# EAGLE design core-feather-shield-adc-imu-basic_v2_0 (EAGLE 9.5.0)
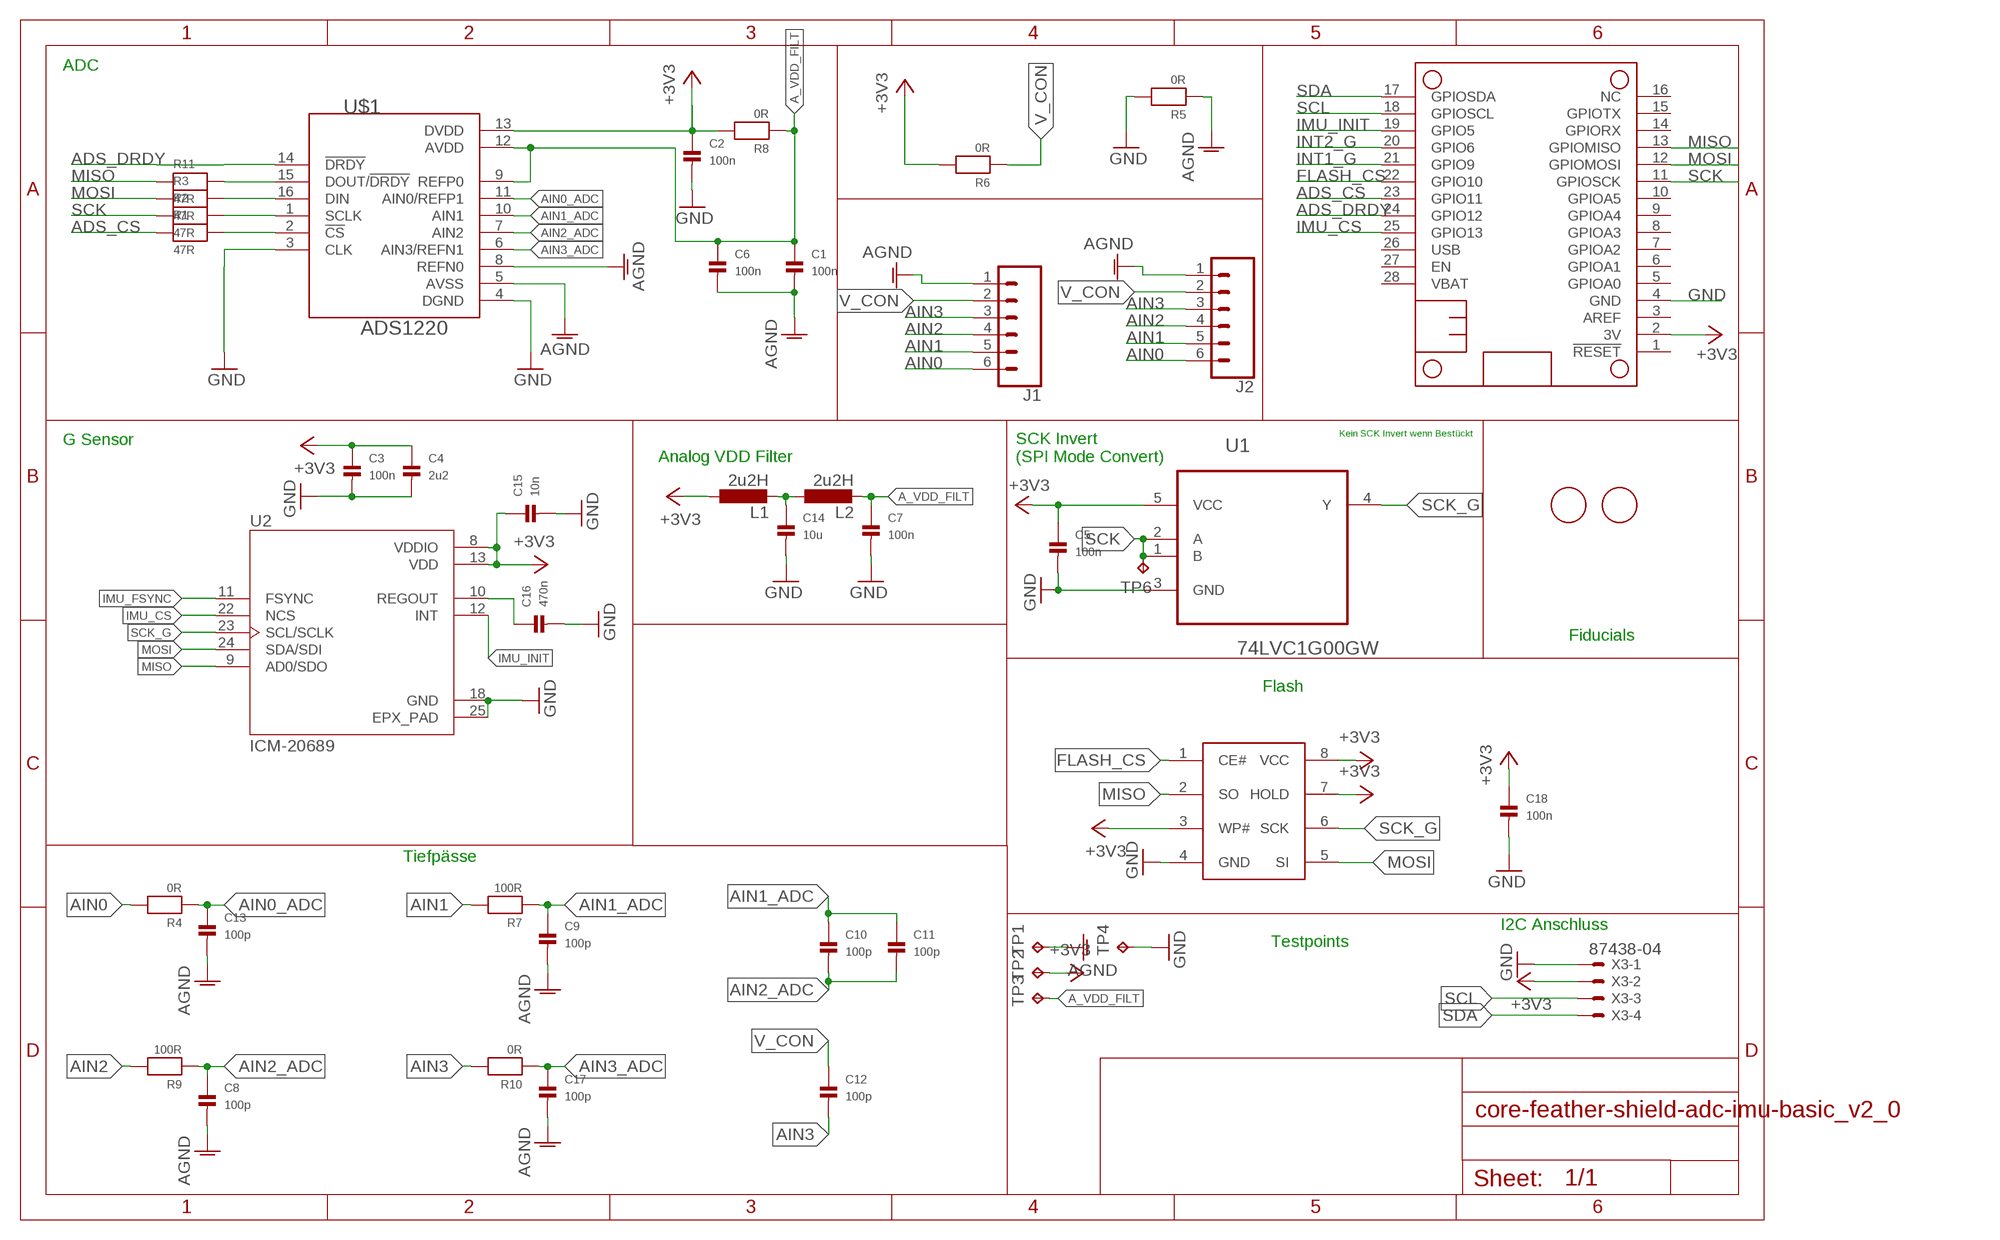
[diagram p0: schematic, sheet 1]

## Parts
C1  100n  CAP_CERAMIC0402  [0402]
C2  100n  CAP_CERAMIC0402  [0402]
C3  100n  CAP_CERAMIC0402  [0402]
C4  2u2  CAP_CERAMIC0402  [0402]
C5  100n  CAP_CERAMIC0402  [0402]
C6  100n  CAP_CERAMIC0402  [0402]
C7  100n  CAP_CERAMIC0402  [0402]
C8  100p  CAP_CERAMIC0402  [0402]
C9  100p  CAP_CERAMIC0402  [0402]
C10  100p  CAP_CERAMIC0402  [0402]
C11  100p  CAP_CERAMIC0402  [0402]
C12  100p  CAP_CERAMIC0402  [0402]
C13  100p  CAP_CERAMIC0402  [0402]
C14  10u  CAP_CERAMIC0402  [0402]
C15  10n  CAP_CERAMIC0402  [0402]
C16  470n  CAP_CERAMIC0402  [0402]
C17  100p  CAP_CERAMIC0402  [0402]
C18  100n  CAP_CERAMIC0402  [0402]
J1  CONN_06SMD_MALE  [1X06_SMD_MALE]
J2  CONN_06SMD_MALE  [1X06_SMD_MALE]
L1  2u2H  L-EUL0805  [L0805]
L2  2u2H  L-EUL0805  [L0805]
MS1  FEATHERWING  [FEATHERWING]
R1  47R  RESISTOR0402  [0402]
R2  47R  RESISTOR0402  [0402]
R3  47R  RESISTOR0402  [0402]
R4  0R  RESISTOR0402  [0402]
R5  0R  RESISTOR0402  [0402]
R6  0R  RESISTOR0402  [0402]
R7  100R  RESISTOR0402  [0402]
R8  0R  RESISTOR0402  [0402]
R9  100R  RESISTOR0402  [0402]
R10  0R  RESISTOR0402  [0402]
R11  47R  RESISTOR0402  [0402]
TP1  TPTP10R  [TP10R]
TP2  TPTP10R  [TP10R]
TP3  TPTP10R  [TP10R]
TP4  TPTP10R  [TP10R]
TP6  TPTP10R  [TP10R]
U1  74LVC1G00GW  [SOT65P210X110-5N]
U2  ICM-20689  [QFN50P400X400X95-25N]
U$1  ADS1220  [TSSOP-16]
U$2  IS25LP128F-JKLE  [WSON8]
U$8  FIDUCIAL  [FIDUCIAL_1MM]
U$9  FIDUCIAL  [FIDUCIAL_1MM]
X3  87438-04  [87438-04]

## Nets
+3V3: C2.1 C3.1 C4.1 C5.1 C15.1 C18.1 L1.1 MS1.2(3V) R6.2 R8.2 TP2.TP U1.5(VCC) U2.8(VDDIO) U2.13(VDD) U$1.13(DVDD) U$2.3(WP#) U$2.7(HOLD) U$2.8(VCC) X3.2
A_VDD_FILT: C1.1 C6.1 C7.1 L2.2 R8.1 TP3.TP U$1.9(REFP0) U$1.12(AVDD)
ADS_CS: MS1.23(GPIO11) R1.1
ADS_DRDY: MS1.24(GPIO12) U$1.14(!DRDY)
AGND: C1.2 C6.2 C8.2 C9.2 C13.2 C17.2 J1.1 J2.1 R5.1 TP1.TP U$1.5(AVSS) U$1.8(REFN0)
AIN0: J1.6 J2.6 R4.2
AIN0_ADC: C13.1 R4.1 U$1.11(AIN0/REFP1)
AIN1: J1.5 J2.5 R7.2
AIN1_ADC: C9.1 C10.1 C11.1 R7.1 U$1.10(AIN1)
AIN2: J1.4 J2.4 R9.2
AIN2_ADC: C8.1 C10.2 C11.2 R9.1 U$1.7(AIN2)
AIN3: C12.2 J1.3 J2.3 R10.2
AIN3_ADC: C17.1 R10.1 U$1.6(AIN3/REFN1)
FLASH_CS: MS1.22(GPIO10) U$2.1(CE#)
GND: C2.2 C3.2 C4.2 C5.2 C7.2 C14.2 C15.2 C16.2 C18.2 MS1.4(GND) R5.2 TP4.TP U1.3(GND) U2.18(GND) U2.25(EPX_PAD) U$1.4(DGND) U$2.4(GND) X3.1
IMU_CS: MS1.25(GPIO13) U2.22(NCS)
IMU_FSYNC: U2.11(FSYNC)
IMU_INIT: MS1.19(GPIO5) U2.12(INT)
INT1_G: MS1.21(GPIO9)
INT2_G: MS1.20(GPIO6)
MISO: MS1.13(GPIOMISO) R11.1 U2.9(AD0/SDO) U$2.2(SO)
MOSI: MS1.12(GPIOMOSI) R3.1 U2.24(SDA/SDI) U$2.5(SI)
N$1: R11.2 U$1.15(DOUT/!DRDY)
N$2: C14.1 L1.2 L2.1
N$3: R3.2 U$1.16(DIN)
N$4: R2.2 U$1.1(SCLK)
N$5: R1.2 U$1.2(!CS)
N$6: C16.1 U2.10(REGOUT)
N$7: U$1.3(CLK)
SCK: MS1.11(GPIOSCK) R2.1 TP6.TP U1.1(B) U1.2(A)
SCK_G: U1.4(Y) U2.23(SCL/SCLK) U$2.6(SCK)
SCL: MS1.18(GPIOSCL) X3.3
SDA: MS1.17(GPIOSDA) X3.4
V_CON: C12.1 J1.2 J2.2 R6.1
Unconnected: MS1.1(!RESET) MS1.3(AREF) MS1.5(GPIOA0) MS1.6(GPIOA1) MS1.7(GPIOA2) MS1.8(GPIOA3) MS1.9(GPIOA4) MS1.10(GPIOA5) MS1.14(GPIORX) MS1.15(GPIOTX) MS1.16(NC) MS1.26(USB) MS1.27(EN) MS1.28(VBAT)

## Notes on the sheet
- ADC
- Kein SCK Invert wenn Bestückt
- G Sensor
- Analog VDD Filter
- SCK Invert
  (SPI Mode Convert)
- Fiducials
- Flash
- Tiefpässe
- I2C Anschluss
- Testpoints

## Library data of the parts
C1-C18 = microbuilder:CAP_CERAMIC: Ceramic Capacitors 0402 - 0402 Surface Mount Capacitors 16pF 50V 5% [Digikey: 445-4899-2-ND] 18pF 50V 5% [Digikey: 490-1281-2-ND] 22pF 50V 5% [Digikey: 490-1283-2-ND] 68pF 50V 5% [Digikey: 490-1289-2-ND] 0.1uF 10V 10% [Digikey: 490-1318-2-ND] 1.0uF 6.3V 10% [Digikey: 490-1320-2-ND] 0603 - 0603 Surface Mount Capacitors 16 pF 50V 5% [Digikey: 445-5051-2-ND] 22 pF 50V [Digikey: PCC220ACVTR-ND] 33 pF 50V 5% [Digikey: 490-1415-1-ND] 56pF 50V 5% [Digikey: 490-1421-1-ND] 220pF 50V 5% [Digikey: 445-1285-1-ND] 680 pF 50V 2200 pF 50V 5% C0G [Digikey: 445-1297-1-ND] 5600 pF 100V 5% X7R [Digikey: 478-3711-1-ND] 0.1 µF 25V 10% [Digikey: PCC2277TR-ND] 0.22 µF 16V 10% X7R [Digikey: 445-1318-1-ND] 1.0 µF 25V 10% [Digikey: 445-5146-2-ND] 0603 - RF Specific 3pF 250V +/-0.1pF RF [Digikey: 712-1347-1-ND] 18 pF 250V 5% [Digikey: 478-3505-1-ND or 712-1322-1-ND] 56 pF 250V 5% C0G RF [Digikey: 490-4867-1-ND] 68 pF 250V RF [Digikey: 490-4868-1-ND] 0805 - 0805 Surface Mount Capacitors 220 pF 250V 2% RF Ceramic Capacitor [Digikey: 712-1398-1-ND] 1000 pF 50V 2% NP0 Ceramic Capacitor [Digikey: 478-3760-1-ND] 0.1 µF 25V 10% Ceramic Capacitor [Digikey: PCC1828TR-ND] 1.0 µF 16V 10% Ceramic Capacitor[Digikey: 490-1691-2-ND] 10.0 µF 10V 10% Ceramic Capacitor[Digikey: 709-1228-1-ND] 10.0 uF 16V 10% Ceramic Capacitor [Digikey: 478-5165-2-ND] 47 uF 6.3V 20% Ceramic Capacitor [Digikey: 587-1779-1-ND or 399-5506-1-ND] 1206 - 1206 Surface Mount Capacitors 47uF 10V 20% Ceramic Capacitor [Digikey: 490-5528-1-ND or 399-5508-1-ND or 445-6010-1-ND] 100uF 6.3V -20%, +80% Y5V Ceramic Capacitor (Digikey: 490-4512-1-ND, Mouser: 81-GRM31CF50J107ZE1L)
J1 J2 = SparkFun-Connectors:CONN_06: Multi connection point. Often used as Generic Header-pin footprint for 0.1 inch spaced/style header connections On any of the 0.1 inch spaced packages, you can populate with these: Break Away Headers - Straight <https://www.sparkfun.com/products/116> (PRT-00116) Break Away Male Headers - Right Angle <https://www.sparkfun.com/products/553> (PRT-00553) Female Headers <https://www.sparkfun.com/products/115> (PRT-00115) Break Away Headers - Machine Pin <https://www.sparkfun.com/products/117> (PRT-00117) Break Away Female Headers - Swiss Machine Pin <https://www.sparkfun.com/products/743> (PRT-00743) Arduino Stackable Header - 6 Pin <https://www.sparkfun.com/products/9280> (PRT-09280) For SCREWTERMINALS and SPRING TERMINALS visit here: Screw Terimnals on SparkFun.com <https://www.sparkfun.com/search/results?term=Screw+Terminals> (5mm/3.5mm/2.54mm spacing) This device is also useful as a general connection point to wire up your design to another part of your project. Our various solder wires solder well into these plated through hole pads. Hook-Up Wire - Assortment (Stranded, 22 AWG) <https://www.sparkfun.com/products/11375> (PRT-11375) Hook-Up Wire - Assortment (Solid Core, 22 AWG) <https://www.sparkfun.com/products/11367> (PRT-11367) View the entire wire category on our website here <https://www.sparkfun.com/categories/141>; PROD_ID: CONN-11293
L1 L2 = rcl:L-EU: INDUCTOR, European symbol
MS1 = adafruit:FEATHERWING
R1-R11 = microbuilder:RESISTOR: Resistors 0402 - 0402 Surface Mount Package 22 Ohm 1% 1/16W [Digikey: 311-22.0LRTR-ND] 33 Ohm 5% 1/16W 1.0K 5% 1/16W 1.5K 5% 1/16W 2.0K 1% 1/16W 10.0K 1% 1/16W [Digikey: 311-10.0KLRTR-ND] 10.0K 5% 1/16W [Digikey: RMCF0402JT10K0TR-ND] 12.1K 1% 1/16W [Digikey: 311-22.0LRTR-ND] 100.0K 5% 1/16W 0603 - 0603 Surface Mount Package 0 Ohm 1/10 Watt 1% Resistor 15 Ohm 1/10 Watt 1% Resistor 33 Ohm 1/10 Watt 1% Resistor 49.9 Ohm 1/10 Watt 1% Resistor 100 Ohm 1/10 Watt 1% Resistor 150 Ohm 1/10 Watt 1% Resistor 240 Ohm 1/10 Watt 1% Resistor 390 Ohm 1/10 Watt 1% Resistor 560 Ohm 1/10 Watt 1% Resistor 680 Ohm 1/10 Watt 1% Resistor 750 Ohm 1/10 Watt 1% Resistor 1.0K Ohm 1/10 Watt 1% Resistor 1.5K Ohm 1/10 Watt 1% Resistor 2.0K Ohm 1/10 Watt 1% Resistor 2.2K Ohm 1/10 Watt 1% Resistor 3.3K Ohm 1/10 Watt 1% Resistor 4.7K Ohm 1/10 Watt 1% Resistor 10.0K Ohm 1/10 Watt 1% Resistor 12.0K Ohm 1/10 Watt 1% Resistor 12.1K Ohm 1/10 Watt 1% Resistor 20.0K Ohm 1/10 Watt 1% Resistor 33.0K Ohm 1/10 Watt 1% Resistor 100.0K Ohm 1/10 Watt 1% Resistor 0805 - 0805 Surface Mount Package 0 Ohm 1/8 Watt 1% Resistor 33 Ohm 1/8 Watt 1% Resistor 100 Ohm 1/8 Watt 1% Resistor 150 Ohm 1/8 Watt 1% Resistor 200 Ohm 1/8 Watt 1% Resistor 240 Ohm 1/8 Watt 1% Resistor 330 Ohm 1/8 Watt 1% Resistor 390 Ohm 1/8 Watt 1% Resistor 470 Ohm 1/8 Watt 1% Resistor 1.0K Ohm 1/8 Watt 1% Resistor 1.5K Ohm 1/8 Watt 1% Resistor 2.0K Ohm 1/8 Watt 1% Resistor 4.7K Ohm 1/8 Watt 1% Resistor 5.1K Ohm 1/8 Watt 1% Resistor 5.6K Ohm 1/8 Watt 1% Resistor 10.0K Ohm 1/8 Watt 1% Resistor 22.0K Ohm 1/8 Watt 1% Resistor 33.0K Ohm 1/8 Watt 1% Resistor 100K Ohm 1/8 Watt 1% Resistor 1206 - 1206 Surface Mount Package 2012 - 2010 Surface Mount Package 0.11 Ohm 1/2 Watt 1% Resistor - Digikey: RHM.11UCT-ND
TP1-TP4 TP6 = testpad:TP: Test pad
U1 = 74LVC1G00GW:74LVC1G00GW: Single 2-input NAND gate; AVAILABILITY: Unavailable; DESCRIPTION: NAND Gate 1-Element 2-IN CMOS 5-Pin TSSOP T/R; MF: Nexperia; MP: 74LVC1G00GW; PACKAGE: None; PRICE: None
U2 = ICM-20689:ICM-20689: 6-Axis Drone/Vr/Iot Solution (Pi); AVAILABILITY: Unavailable; DESCRIPTION: 6-Axis Drone/Vr/Iot Solution _Pi; MF: TDK InvenSense; MP: ICM-20689; PACKAGE: QFN-24 InvenSense; PRICE: None
U$1 = circuitects:ADS1220
U$2 = IS25LP128F:IS25LP128F-JKLE
U$8 U$9 = audio amplifier example:FIDUCIAL: For use by pick and place machines to calibrate the vision/machine, 1mm By microbuilder.eu
X3 = con-molex:87438-04: Wire-to-Board 1.50mm (.059") Pitch Header - Right Angle, SMT, Shrouded Source: http://www.molex.com/product/micro/87438.html; MF: MOLEX; OC_FARNELL: unknown; OC_NEWARK: unknown

## Net classes
0 default: width 0.127 mm

## Board
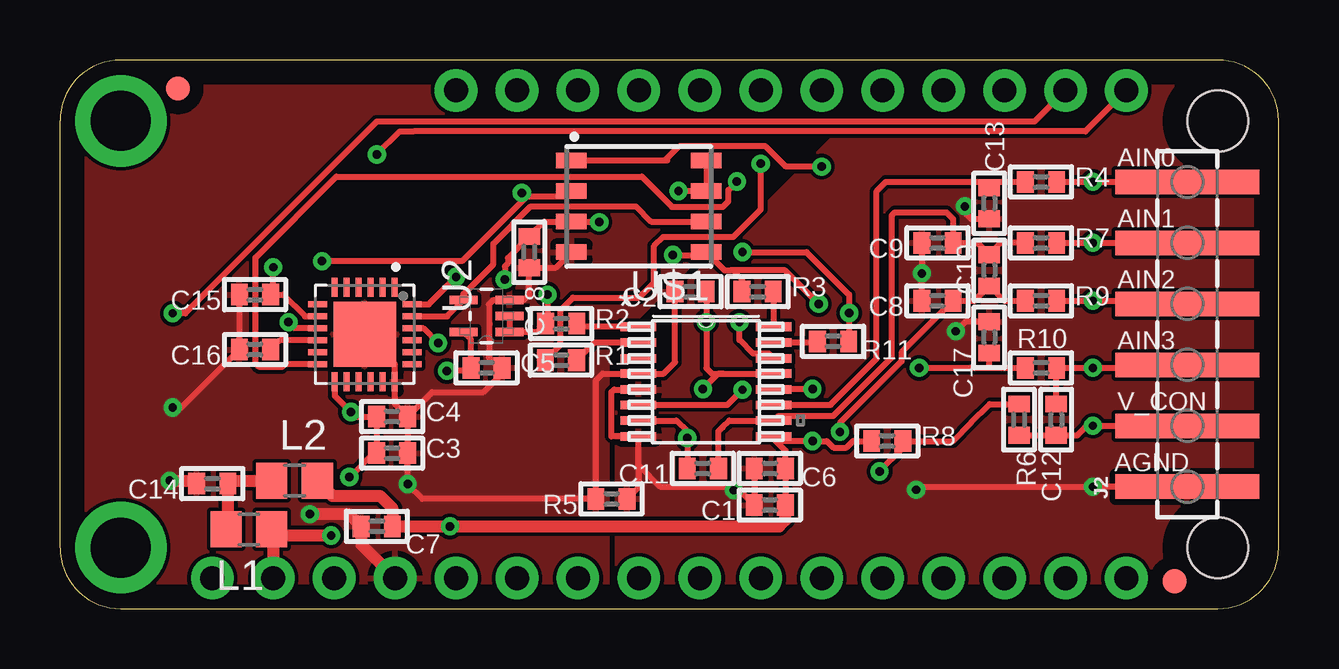
[diagram p1: board, top side]
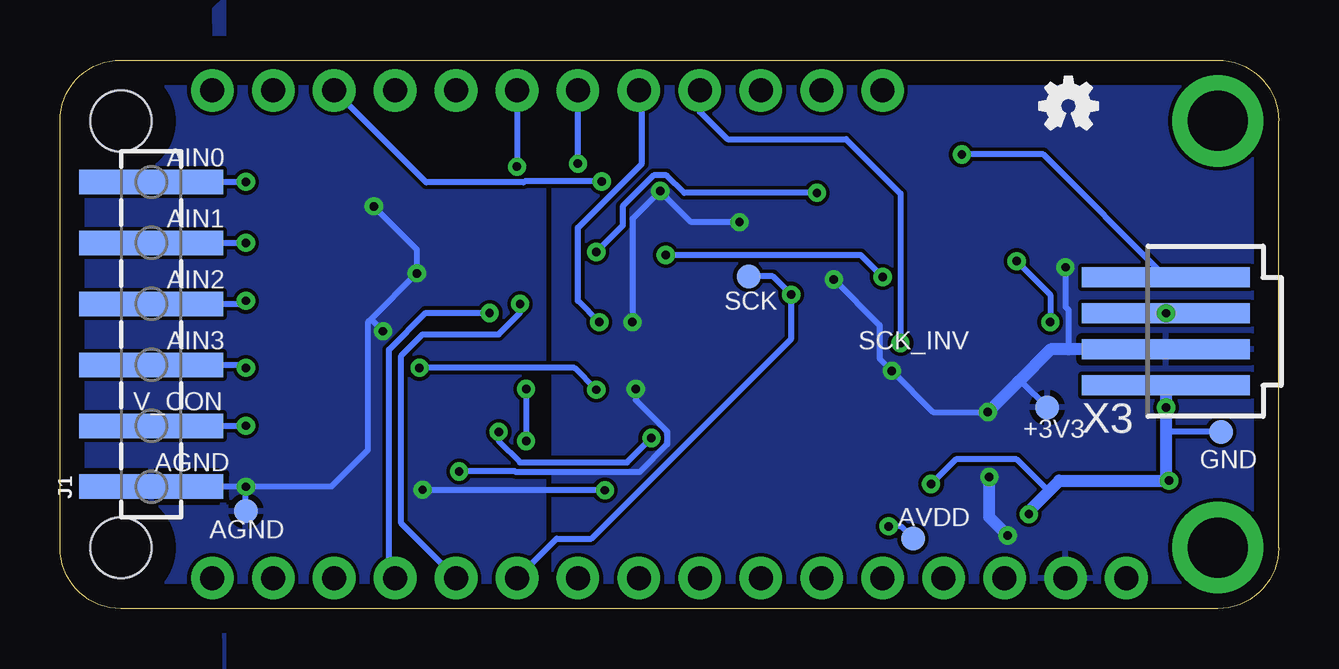
[diagram p2: board, bottom side, seen from below]

Size 50.8 x 22.86 mm. Coordinates in mm from the lower left corner, seen from the top.
Outline: 0,2.54 0,20.32
Copper layers (1*16): Top 0.035mm / dielectric 1.5mm / Bottom 0.035mm
Design rules "default": minimum track width 6mil, minimum drill 0.35mm, track to track 6mil, track to pad 6mil, pad to pad 6mil, via to via 6mil, smd to smd 6mil, copper to edge 40mil, drill to drill 6mil, minimum pad ring 10mil, minimum via ring 8mil, stop-mask expansion 4mil, vias tented up to drill 0mil, thermal gap 10mil

### Footprints (pad centres in the part's own frame; a part is rotated, then mirrored left to right if it is on the bottom)
0402 = smd 0.7 x 0.9: 1 -0.65,0; 2 0.65,0
1X06_SMD_MALE = smd 1.02 x 6: 1 0,0; 2 2.54,0; 3 5.08,0; 4 7.62,0; 5 10.16,0; 6 12.7,0
L0805 = smd 1.3 x 1.5: 1 -0.95,0; 2 0.95,0
FEATHERWING = drill 1 pad 1.778: 1 6.35,1.27; 2 8.89,1.27; 3 11.43,1.27; 4 13.97,1.27; 5 16.51,1.27; 6 19.05,1.27; 7 21.59,1.27; 8 24.13,1.27; 9 26.67,1.27; 10 29.21,1.27; 11 31.75,1.27; 12 34.29,1.27; 13 36.83,1.27; 14 39.37,1.27; 15 41.91,1.27; 16 44.45,1.27; 17 44.45,21.59; 18 41.91,21.59; 19 39.37,21.59; 20 36.83,21.59; 21 34.29,21.59; 22 31.75,21.59; 23 29.21,21.59; 24 26.67,21.59; 25 24.13,21.59; 26 21.59,21.59; 27 19.05,21.59; 28 16.51,21.59 | drill 2.5 pad 3.81: P$1 2.54,20.32; P$2 2.54,2.54 | hole 2.54: 48.26,20.32; 48.26,2.54
TP10R = smd 1 x 1: TP 0,0
SOT65P210X110-5N = smd 1.168 x 0.356: 1 -0.965,0.66; 2 -0.965,0; 3 -0.965,-0.66; 4 0.965,-0.66; 5 0.965,0.66
QFN50P400X400X95-25N = smd 0.79 x 0.26: 1 -1.97,1.25; 2 -1.97,0.75; 3 -1.97,0.25; 4 -1.97,-0.25; 5 -1.97,-0.75; 6 -1.97,-1.25; 13 1.97,-1.25; 14 1.97,-0.75; 15 1.97,-0.25; 16 1.97,0.25; 17 1.97,0.75; 18 1.97,1.25 | smd 0.26 x 0.79: 7 -1.25,-1.97; 8 -0.75,-1.97; 9 -0.25,-1.97; 10 0.25,-1.97; 11 0.75,-1.97; 12 1.25,-1.97; 19 1.25,1.97; 20 0.75,1.97; 21 0.25,1.97; 22 -0.25,1.97; 23 -0.75,1.97; 24 -1.25,1.97 | smd 2.7 x 2.6: 25 0,0
TSSOP-16 = smd 1.473 x 0.356: 1 -2.819,2.656; 2 -2.819,1.996; 3 -2.819,1.335; 4 -2.819,0.7; 5 -2.819,0.04; 6 -2.819,-0.595; 7 -2.819,-1.256; 8 -2.819,-1.916; 9 2.819,-1.916; 10 2.819,-1.256; 11 2.819,-0.595; 12 2.819,0.04; 13 2.819,0.7; 14 2.819,1.335; 15 2.819,1.996; 16 2.819,2.656
WSON8 = smd 0.635 x 1.27: 1 -1.905,-2.81; 2 -0.635,-2.81; 3 0.635,-2.81; 4 1.905,-2.81; 5 1.905,2.81; 6 0.635,2.81; 7 -0.635,2.81; 8 -1.905,2.81
FIDUCIAL_1MM = smd 1 x 1: 1 0,0
87438-04 = smd 7 x 0.85: 1 0,2.25; 2 0,0.75; 3 0,-0.75; 4 0,-2.25

### Placement (x,y rotation side)
C1  29.59,4.32 180 top
C2  26.29,13.21 180 top
C3  13.84,6.48 0 top
C4  13.84,8 0 top
C5  17.78,10.03 0 top
C6  29.59,5.84 180 top
C7  13.21,3.43 180 top
C8  36.58,12.83 180 top
C9  36.58,15.24 180 top
C10  38.74,14.1 270 top
C11  26.8,5.84 180 top
C12  41.53,7.87 90 top
C13  38.74,16.89 270 top
C14  6.35,5.21 180 top
C15  8.13,13.08 180 top
C16  8.13,10.79 180 top
C17  38.74,11.3 90 top
C18  19.56,14.86 270 top
FRAME2  FRAME-LETTER  [CREATIVE_COMMONS]  4.06,-14.86 0 top  (outside the outline)
J1  46.99,5.08 90 bottom
J2  46.99,5.08 90 top
L1  7.87,3.3 180 top
L2  9.78,5.33 0 top
LOGO1  OSHW-LOGOMINI  [OSHW-LOGO-MINI]  8.76,20.95 0 bottom
LOGO2  REVISION  [REVISION]  15.49,-17.4 0 top  (outside the outline)
MS1  0,0 0 top
R1  20.88,10.35 0 top
R2  20.89,11.87 0 top
R3  29.08,13.21 0 top
R4  40.89,17.78 0 top
R5  22.99,4.57 180 top
R6  39.98,7.87 90 top
R7  40.89,15.24 0 top
R8  34.48,6.99 0 top
R9  40.89,12.83 0 top
R10  40.89,10.03 0 top
R11  32.23,11.14 180 top
TP1  43.05,4.06 0 bottom
TP2  9.65,8.38 0 bottom
TP3  15.24,2.92 0 bottom
TP4  2.41,7.37 0 bottom
TP6  22.1,13.84 0 bottom
U1  17.78,12.19 180 top
U2  12.7,11.43 270 top
U$1  26.93,9.09 0 top
U$2  24.13,16.76 270 top
U$8  4.93,21.66 0 top
U$9  46.47,1.14 0 top
X3  4.7,11.56 180 bottom

### Tracks (layer width: path | path; a pad name or v marks a point on that pad's centre or on a via)
+3V3  (via drill 0.35)
  Top 0.254: U1.5 17.13,11.22 C5.1 17,9.91 v16.13,9.91 | U2.13 11.45,8.87 v12.13,8.19 12.32,8 C4.1 C3.1 13.06,6.48 v12.06,5.48 | v26.94,11.94 C2.1 v26.94,11.94 | v26.94,11.94 26.94,10.02 27.18,9.78 27.69,9.78 | 27.69,9.78 29.73,9.78 U$1.13 | U2.8 10.21,12.18 9.31,13.08 C15.1 8.89,13.19 v8.89,14.22 | U$2.8 U$2.7 v25.78,17.4 | v22.48,16.11 22.46,16.13 U$2.3 20.18,16.13 C18.1 18.67,14.62 18.67,14.39 18.54,14.26 v18.54,13.72 | R6.2 38.75,8.52 37.97,7.75 37.21,6.99 R8.2 35.13,6.68 v34.16,5.71 | 27.69,9.78 27.42,9.78 v26.8,9.15
  Top 0.508: MS1.2 8.89,3.24 L1.1 9.08,3.05 v11.3,3.05
  Bottom 0.254: v12.13,8.19 14.41,8.19 v16.13,9.91 16.64,10.41 16.64,11.81 v18.54,13.72 | v8.89,14.22 8.89,12.57 8.76,12.45 8.76,10.81 | v22.48,16.11 24.49,16.11 v25.78,17.4 26.94,16.24 v26.94,11.94 | TP2.TP 10.73,9.46 10.86,9.46 | v34.16,5.71 31.82,5.71 31.79,5.69 26.64,5.69 25.49,6.84 25.49,7.38 26.8,8.69 v26.8,9.15
  Bottom 0.508: v11.3,3.05 12.06,3.81 v12.06,5.48 | X3.2 8.76,10.81 9.51,10.81 10.86,9.46 v12.13,8.19
  pour Bottom: 0.12,22.66 30.25,22.66 30.25,0.12 0.12,0.12
A_VDD_FILT  (via drill 0.35)
  Top 0.254: C1.1 C6.1 30.24,6.59 29.75,7.08 | 29.75,7.08 U$1.9 | U$1.12 29.77,9.15 v31.37,9.15 | 29.75,7.08 29.84,6.99 v31.37,6.99 31.96,6.99 32.24,6.71 32.78,6.71 33.06,6.99 R8.1
  Top 0.508: L2.2 11.36,4.7 13.33,4.7 13.86,4.18 C7.1 v16.26,3.43 29.97,3.43 30.24,3.7 C1.1
  Bottom 0.254: v31.37,9.15 v31.37,6.99 | TP3.TP 15.75,3.43 v16.26,3.43
ADS_CS  (via drill 0.35)
  Top 0.254: R1.1 20.87,10.99 20.87,12.44 21.38,12.95 24.13,12.95 24.77,13.59 24.77,15.11 25.15,15.49 28.07,15.49 29.21,16.64 v29.21,18.54
  Bottom 0.254: v29.21,18.54 MS1.23
ADS_DRDY  (via drill 0.35)
  Top 0.254: U$1.14 29.54,10.63 28.89,10.63 28.32,11.2 v28.32,11.94
  Bottom 0.254: MS1.24 26.54,21.46 26.54,18.54 29.21,15.88 29.21,12.83 v28.32,11.94
AGND  (via drill 0.35)
  Top 0.254: C6.2 C1.2 28.18,5.08 27.94,5.08 | 24.13,5.97 25.02,5.08 27.94,5.08 | 24.13,5.97 24.11,5.99 U$1.8 22.99,7.17 22.99,9.02 23.1,9.13 U$1.5 | C9.2 v35.93,13.97 C8.2 | R5.1 24.13,5.07 24.13,5.97 | J2.1 v43.05,5.08 35.81,5.08 v35.69,4.95 | 27.94,5.08 v28.09,4.93 | C17.2 37.73,11.95 v37.34,11.56 | v37.72,16.76 37.72,16.5 37.97,16.24 C13.2
  Bottom 0.254: v43.05,5.08 J2.1 | TP1.TP v43.05,5.08 | 37.84,12.06 v35.93,13.97 35.93,14.97 v37.72,16.76 | 37.84,12.06 37.97,11.92 37.97,6.6 39.5,5.08 v43.05,5.08 | v28.09,4.93 35.67,4.93 v35.69,4.95 | v37.34,11.56 37.84,12.06
  pour Top: 23.21,0.31 50.59,0.31 50.59,22.71 35.28,22.71 23.21,10.63
  pour Bottom: 30.59,22.66 30.59,0.13 50.76,0.13 50.76,22.66
AGND1
  pour Bottom: 43.93,25.46 43.93,-3.17 44.4,24.99
AIN0  (via drill 0.35)
  Top 0.254: R4.2 v43.05,17.78 J2.6
  Bottom 0.254: J2.6 v43.05,17.78
AIN0_ADC
  Top 0.254: U$1.11 32.12,8.49 34.04,10.41 34.04,17.4 34.42,17.78 38.74,17.78 | 38.74,17.78 R4.1 | C13.1 38.74,17.78
AIN1  (via drill 0.35)
  Top 0.254: R7.2 v43.05,15.24 J2.5
  Bottom 0.254: J2.5 v43.05,15.24
AIN1_ADC
  Top 0.254: R7.1 39.23,15.24 C10.1 38.24,15.24 C9.1 37.23,16.24 36.96,16.51 34.8,16.51 34.67,16.38 34.67,10.47 32.23,8.04 29.95,8.04 U$1.10 27.9,7.83 27.62,7.56 27.45,7.38 C11.1
AIN2  (via drill 0.35)
  Top 0.254: R9.2 v43.05,12.83 46.86,12.83 J2.4
  Bottom 0.254: J2.4 43.18,12.7 v43.05,12.83
AIN2_ADC  (via drill 0.35)
  Top 0.254: R9.1 39.37,12.83 C10.2 38.12,12.83 C8.1 35.08,10.68 35.08,10.31 32.51,7.74 v32.51,7.37 | U$1.7 25.69,7.83 26.15,7.38 v26.15,7.11 C11.2
  Bottom 0.254: v32.51,7.37 32.51,6.99 31.62,6.1 27.16,6.1 v26.15,7.11
AIN3  (via drill 0.35)
  Top 0.254: J2.3 46.86,10.03 v43.05,10.03 R10.2 41.53,10.02 C12.2
  Bottom 0.254: J2.3 43.18,10.16 v43.05,10.03
AIN3_ADC  (via drill 0.35)
  Top 0.152: 38.74,10.54 C17.1
  Top 0.254: U$1.6 27.82,8.49 v28.45,9.12 | v35.81,10.03 38.74,10.03 | 38.74,10.03 R10.1 | 38.74,10.03 38.74,10.54
  Bottom 0.254: v28.45,9.12 29.36,10.03 v35.81,10.03
FLASH_CS  (via drill 0.35)
  Top 0.254: U$2.1 25.32,18.67 25.27,18.72 25.81,19.27 29.42,19.27 30.27,18.41 v31.75,18.41
  Bottom 0.254: MS1.22 v31.75,18.41
GND  (via drill 0.35)
  Top 0.254: U$2.4 20.67,14.21 C18.2 19.56,13.08 19.33,12.85 U1.3 18.06,12.85 17.88,12.68 17.88,10.45 18.43,9.91 | U2.18 13.95,9.27 | 13.95,9.27 13.95,8.54 C4.2 | C4.2 C3.2 v14.49,5.19 15.11,4.57 R5.2 22.34,9.51 22.62,9.79 U$1.4 25.16,9.79 25.64,10.27 C2.2 | U2.25 13.95,10.18 13.95,9.27 | C4.2 15.51,9.02 17.65,9.02 18.43,9.79 18.43,9.91 | 18.43,9.91 C5.2 | C15.2 C16.2 5.06,8.38 v4.7,8.38
  Top 0.508: MS1.4 12.56,2.68 C7.2 12.05,3.94 v10.41,3.94 | v4.57,5.33 5.57,5.33 C14.2
  Bottom 0.254: 9.59,4.89 10.92,6.22 13.46,6.22 v14.49,5.19 | TP4.TP 4.57,7.37 4.7,7.24
  Bottom 0.508: v10.41,3.94 10.41,4.06 9.59,4.89 9.14,5.33 v4.57,5.33 4.7,5.46 4.7,7.24 v4.7,8.38 X3.1
  pour Top: 34.62,22.64 0.24,22.64 0.24,0.19 22.84,0.19 22.84,10.86
IMU_CS  (via drill 0.35)
  Top 0.254: v15.77,11.07 15.15,11.68 U2.22
  Bottom 0.254: MS1.25 24.13,20.7 22.99,19.56 18.03,19.56 15.77,17.29 v15.77,11.07
IMU_INIT  (via drill 0.35)
  Top 0.254: U2.12 9.36,10.18 9.24,10.07 8.31,10.07 8.15,10.23 8.15,14.63 11.52,18 24.25,18 25.51,16.74 27.63,16.74 27.85,16.97 27.85,17.44 v28.21,17.8
  Bottom 0.254: v28.21,17.8 31.43,17.8 31.48,17.76 35.54,17.76 MS1.19
MISO  (via drill 0.35)
  Top 0.254: U2.9 9.78,11.68 v9.53,11.94 | U$2.2 21.09,17.17 19.94,17.17 | 19.94,17.17 19.45,17.17 16.76,14.48 15.37,14.48 v10.92,14.48 | R11.1 32.89,11.15 v32.89,12.32 32.89,13.08 31.11,14.86 v28.45,14.86 | 19.94,17.17 19.41,17.17 v19.25,17.33
  Bottom 0.254: v10.92,14.48 9.53,13.08 v9.53,11.94 | v32.89,12.32 33.53,12.32 35.56,12.32 37.08,10.79 37.08,1.52 MS1.13 | v28.45,14.86 27.34,15.96 27.34,16.77 26.05,18.06 25.51,18.06 24.78,17.33 v19.25,17.33
MOSI  (via drill 0.35)
  Top 0.254: 27.94,14.1 27.7,14.1 U$2.5 26.81,14.73 v25.55,14.73 | 27.94,14.1 28.07,14.1 28.43,13.73 R3.1 | v31.62,12.7 30.23,14.1 27.94,14.1 | U2.24 15.37,12.68 v16.51,13.82
  Bottom 0.254: MS1.12 36.58,3.56 36.58,10.54 35.69,11.43 32.51,11.43 31.62,12.32 v31.62,12.7 | v16.51,13.82 17.42,14.73 v25.55,14.73
N$1
  Top 0.254: R11.2 31.52,11.09 U$1.15
N$2
  Top 0.508: L2.1 7.13,5.33 C14.1 7,3.38 L1.2
N$3
  Top 0.254: R3.2 29.73,11.76 U$1.16
N$4
  Top 0.254: U$1.1 21.67,11.74 R2.2
N$5
  Top 0.254: U$1.2 22.27,11.09 R1.2
N$6
  Top 0.254: U2.10 9.16,11.18 C16.1
SCK  (via drill 0.35)
  Top 0.254: U1.2 U1.1 19.9,11.53 R2.1 20.32,11.95 v20.32,13.08
  Bottom 0.254: MS1.11 30.1,2.92 28.65,2.92 20.32,11.25 v20.32,13.08 21.08,13.84 TP6.TP
SCK_G
  Top 0.254: U2.23 16.14,12.18 U1.4 16.82,13.11 18.07,14.36 18.07,15.21 19.62,16.76 24,16.76 24.64,16.13 U$2.6
SCL  (via drill 0.35)
  Top 0.254: MS1.18 40.62,20.3 13.21,20.3 5.22,12.31 X3.3
  other vias: 4.7,12.31
SDA  (via drill 0.35)
  Top 0.254: MS1.17 42.75,19.89 14.73,19.89 14.17,19.89 v13.21,18.92
  Bottom 0.254: X3.4 9.81,18.92 v13.21,18.92
V_CON  (via drill 0.35)
  Top 0.254: J2.2 v43.05,7.62 42.8,7.62 42.4,7.22 C12.1 R6.1
  Bottom 0.254: J2.2 v43.05,7.62

### Text on the board
bPlace: SCK | SCK_INV | +3V3 | GND | AVDD | AGND
tNames: AIN0 | AIN1 | AIN2 | AIN3 | V_CON | AGND
bNames: AIN0 | AIN1 | AIN2 | AIN3 | V_CON | AGND
tDocu: M. Hessinger | S. Suppelt